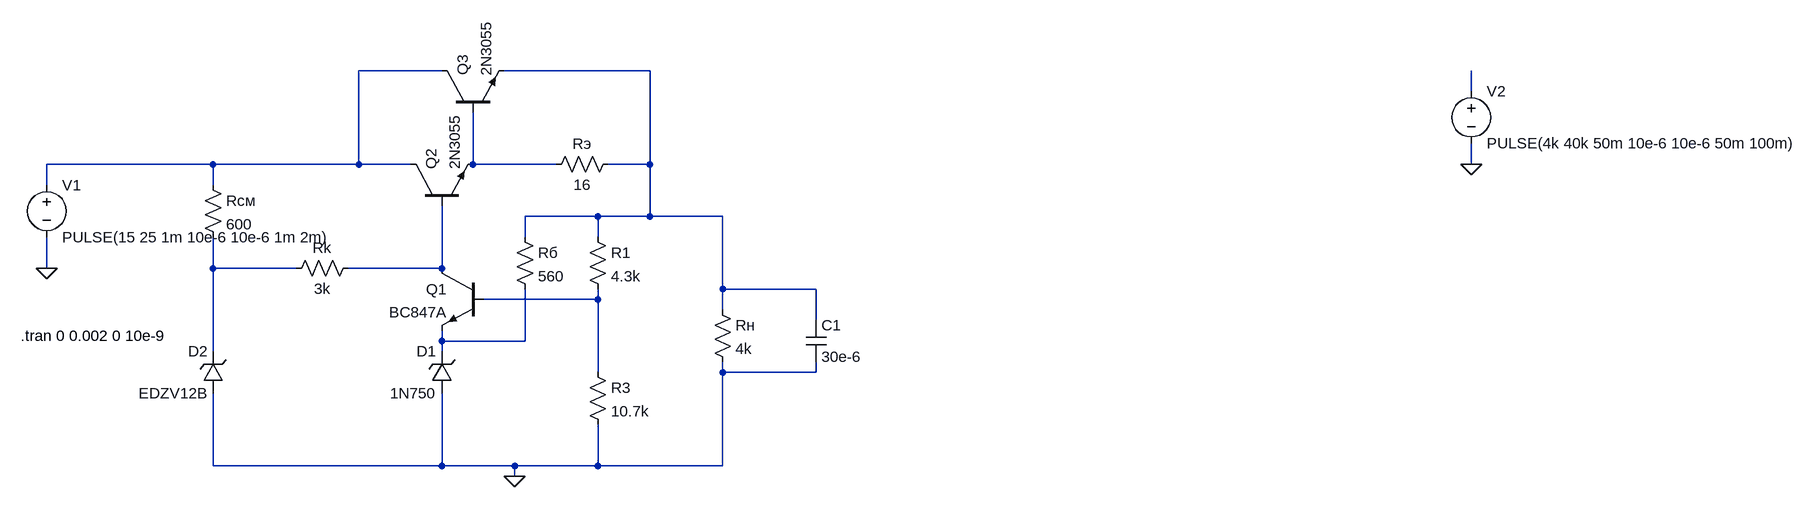
[diagram p0: schematic Draft6.asc]
Draft6.asc, the LTspice schematic file:
Version 4.1
SHEET 1 2700 680
WIRE 576 -176 448 -176
WIRE 896 -176 672 -176
WIRE 2160 -144 2160 -176
WIRE 224 -32 -32 -32
WIRE 448 -32 448 -176
WIRE 448 -32 224 -32
WIRE 528 -32 448 -32
WIRE 624 -32 624 -112
WIRE 752 -32 624 -32
WIRE 896 -32 896 -176
WIRE 896 -32 832 -32
WIRE 2160 -32 2160 -64
WIRE -32 0 -32 -32
WIRE 224 0 224 -32
WIRE 816 48 704 48
WIRE 896 48 896 -32
WIRE 896 48 816 48
WIRE 1008 48 896 48
WIRE 704 80 704 48
WIRE 816 80 816 48
WIRE -32 128 -32 80
WIRE 224 128 224 80
WIRE 352 128 224 128
WIRE 576 128 576 32
WIRE 576 128 432 128
WIRE 1008 160 1008 48
WIRE 1152 160 1008 160
WIRE 816 176 816 160
WIRE 816 176 640 176
WIRE 1008 192 1008 160
WIRE 1152 208 1152 160
WIRE 576 240 576 224
WIRE 704 240 704 160
WIRE 704 240 576 240
WIRE 224 256 224 128
WIRE 576 256 576 240
WIRE 816 288 816 176
WIRE 1008 288 1008 272
WIRE 1152 288 1152 272
WIRE 1152 288 1008 288
WIRE 224 432 224 320
WIRE 576 432 576 320
WIRE 576 432 224 432
WIRE 688 432 576 432
WIRE 816 432 816 368
WIRE 816 432 688 432
WIRE 1008 432 1008 288
WIRE 1008 432 816 432
WIRE 688 448 688 432
FLAG -32 128 0
FLAG 688 448 0
FLAG 2160 -32 0
SYMBOL voltage -32 -16 R0
SYMATTR InstName V1
SYMATTR Value PULSE(15 25 1m 10e-6 10e-6 1m 2m)
SYMBOL res 208 -16 R0
SYMATTR InstName Rсм
SYMATTR Value 600
SYMBOL res 448 112 R90
WINDOW 0 0 56 VBottom 2
WINDOW 3 32 56 VTop 2
SYMATTR InstName Rk
SYMATTR Value 3k
SYMBOL npn 640 128 M0
SYMATTR InstName Q1
SYMATTR Value BC847A
SYMBOL npn 528 32 R270
SYMATTR InstName Q2
SYMATTR Value 2N3055
SYMBOL npn 576 -112 R270
SYMATTR InstName Q3
SYMATTR Value 2N3055
SYMBOL res 848 -48 R90
WINDOW 0 0 56 VBottom 2
WINDOW 3 32 56 VTop 2
SYMATTR InstName Rэ
SYMATTR Value 16
SYMBOL zener 240 320 R180
WINDOW 0 24 64 Left 2
WINDOW 3 24 0 Left 2
SYMATTR InstName D2
SYMATTR Value EDZV12B
SYMBOL zener 592 320 R180
WINDOW 0 24 64 Left 2
WINDOW 3 24 0 Left 2
SYMATTR InstName D1
SYMATTR Value 1N750
SYMBOL res 800 64 R0
SYMATTR InstName R1
SYMATTR Value 4.3k
SYMBOL res 688 64 R0
SYMATTR InstName Rб
SYMATTR Value 560
SYMBOL res 800 272 R0
SYMATTR InstName R3
SYMATTR Value 10.7k
SYMBOL res 992 176 R0
SYMATTR InstName Rн
SYMATTR Value 4k
SYMBOL voltage 2160 -160 R0
SYMATTR InstName V2
SYMATTR Value PULSE(4k 40k 50m 10e-6 10e-6 50m 100m)
SYMBOL cap 1136 208 R0
SYMATTR InstName C1
SYMATTR Value 30e-6
TEXT -72 232 Left 2 !.tran 0 0.002 0 10e-9

The netlist it stands for:
* Draft6.asc
V1 N001 0 PULSE(15 25 1m 10e-6 10e-6 1m 2m)
Rсм N001 N005 600
Rk N006 N005 3k
Q1 N006 N007 N008 0 BC847A
Q2 N001 N006 N004 0 2N3055
Q3 N001 N004 N002 0 2N3055
Rэ N002 N004 16
D2 0 N005 EDZV12B
D1 0 N008 1N750
R1 N002 N007 4.3k
Rб N002 N008 560
R3 N007 0 10.7k
Rн N002 0 4k
V2 N003 0 PULSE(4k 40k 50m 10e-6 10e-6 50m 100m)
C1 N002 0 30e-6
.model D D
.lib standard.dio
.model NPN NPN
.model PNP PNP
.lib standard.bjt
.tran 0 0.002 0 10e-9
.backanno
.end